# Altium schematic sheet OnkoMain.SchDoc
size A4
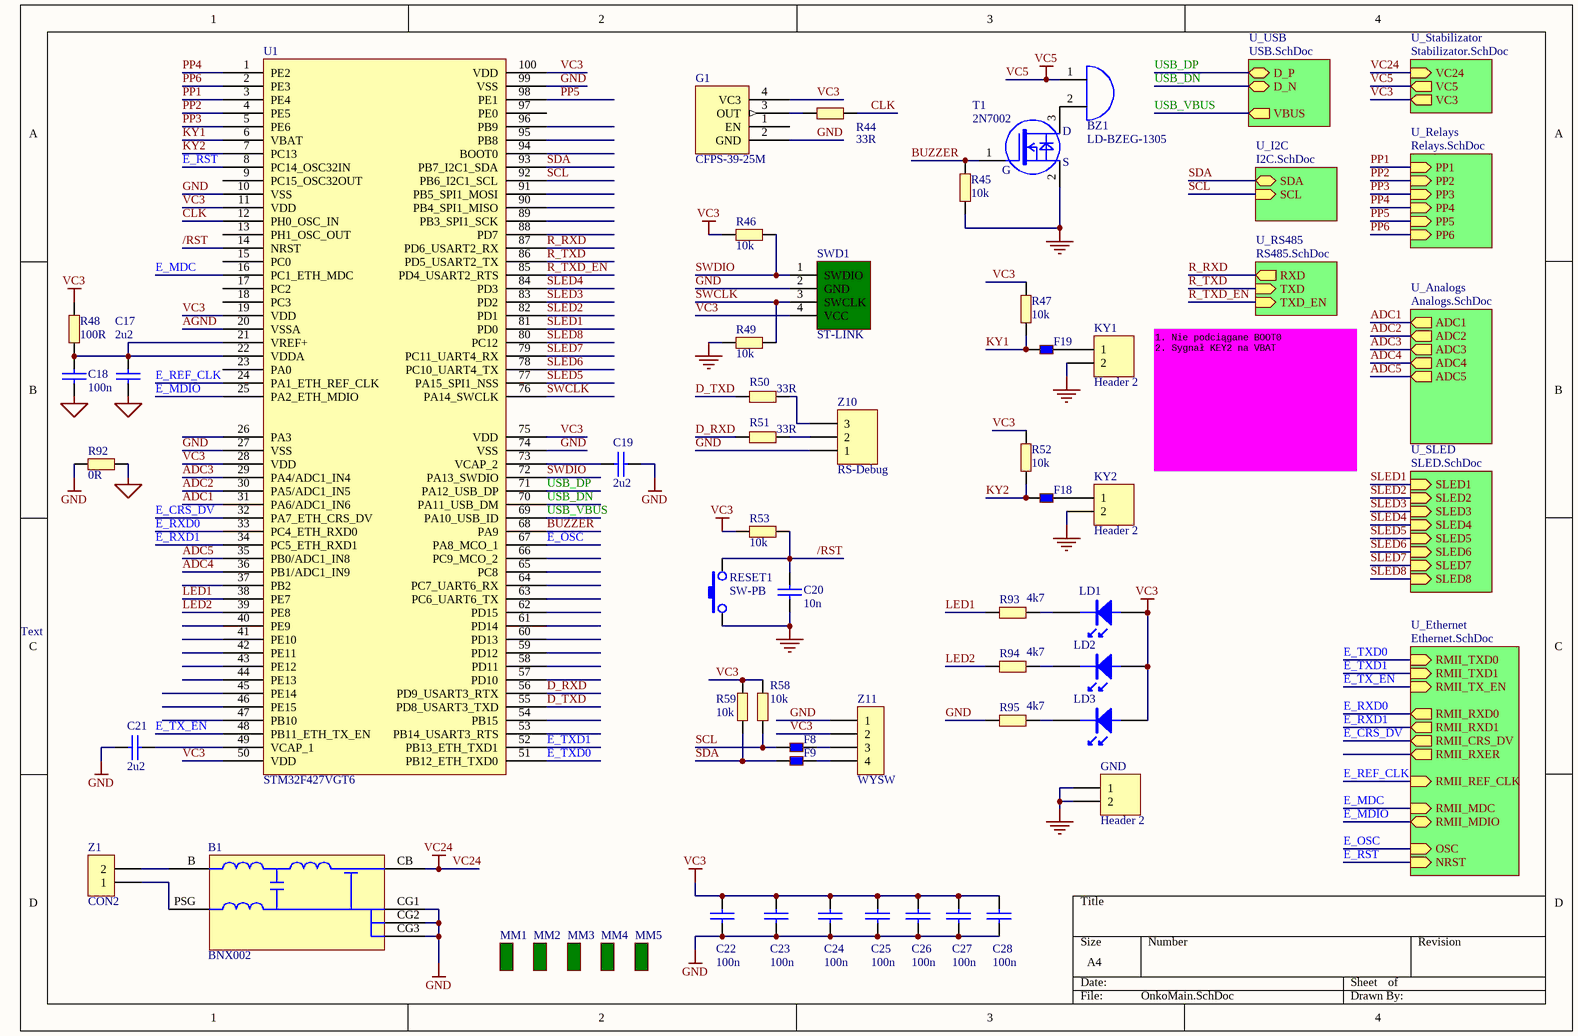
[diagram p0: OnkoMain.SchDoc]

## Parts
B1  BNX002  [BNX002]
BZ1  LD-BZEG-1305  [LD-BZEG-1305]
C17  2u2  [0805C]
C18  100n  [0805C]
C19  2u2  [0805C]
C20  10n  [0805C]
C21  2u2  [0805C]
C22  100n  [0805C]
C23  100n  [0805C]
C24  100n  [0805C]
C25  100n  [0805C]
C26  100n  [0805C]
C27  100n  [0805C]
C28  100n  [0805C]
F8  BLM18BB141SN1D  [0805L]  (value not drawn)
F9  BLM18BB141SN1D  [0805L]  (value not drawn)
F18  BLM18BB141SN1D  [0805L]  (value not drawn)
F19  BLM18BB141SN1D  [0805L]  (value not drawn)
G1  CFPS-39-25M  [GEN_SMD1_1]
GND  Header 2  [HDR1X2]
KY1  Header 2  [HDR1X2]
KY2  Header 2  [HDR1X2]
LD1  (no value)  [0805LG]
LD2  (no value)  [0805LR]
LD3  (no value)  [0805LG]
MM1  (no value)  [REF_CIR]
MM2  (no value)  [REF_CIR]
MM3  (no value)  [REF_SQR]
MM4  (no value)  [REF_SQR]
MM5  (no value)  [PB_FREE_GRAF]
R44  33R  [0805R]
R45  10k  [0805]
R46  10k  [0805R]
R47  10k  [0805R]
R48  100R  [0805]
R49  10k  [0805R]
R50  33R  [0805R]
R51  33R  [0805R]
R52  10k  [0805R]
R53  10k  [0805R]
R58  10k  [0805R]
R59  10k  [0805R]
R92  0R  [0805]
R93  4k7  [0805R]
R94  4k7  [0805R]
R95  4k7  [0805R]
RESET1  SW-PB  [DTSM31N_2]
SWD1  ST-LINK  [PIN4]
T1  2N7002  [SOT23]
U1  STM32F427VGT6  [VQ100_2]
Z1  CON2  [ARC-L-2-5.08]
Z10  RS-Debug  [PIN3]
Z11  WYSW  [PIN4]

## Sub-sheets
U_Analogs = Analogs.SchDoc: ADC1 (out), ADC2 (out), ADC3 (out), ADC4 (out), ADC5 (out)
U_Ethernet = Ethernet.SchDoc: RMII_TXD0 (in), RMII_TX_EN (in), RMII_RXD0 (out), RMII_REF_CLK (in), RMII_CRS_DV (out), RMII_MDC (in), RMII_MDIO (bidir), NRST (in), RMII_TXD1 (in), RMII_RXD1 (out), RMII_RXER (out), OSC (in)
U_I2C = I2C.SchDoc: SCL (in), SDA (bidir)
U_Relays = Relays.SchDoc: PP1 (in), PP2 (in), PP3 (in), PP4 (in), PP5 (in), PP6 (in)
U_RS485 = RS485.SchDoc: TXD (in), TXD_EN (in), RXD (out)
U_SLED = SLED.SchDoc: SLED1 (in), SLED2 (in), SLED3 (in), SLED4 (in), SLED5 (in), SLED6 (in), SLED7 (in), SLED8 (in)
U_Stabilizator = Stabilizator.SchDoc: VC5 (out), VC3 (out), VC24 (in)
U_USB = USB.SchDoc: D_N (bidir), D_P (bidir), VBUS (out)

## Nets
AGND: C17.2 C18.2 R92.1 U1.20(VSSA)
GND: B1.CG1 B1.CG2 B1.CG3 C19.1 C20.2 C21.1 C22.2 C23.2 C24.2 C25.2 C26.2 C27.2 C28.2 G1.2(GND) GND.1 GND.2 KY1.2 KY2.2 R45.2 R49.1 R92.2 R95.2 RESET1.1 SWD1.2(GND) T1.2(S) U1.10(VSS) U1.27(VSS) U1.74(VSS) U1.99(VSS) Z10.1 Z11.1
VC3: C22.1 C23.1 C24.1 C25.1 C26.1 C27.1 C28.1 G1.4(VC3) LD1.A LD2.A LD3.A R46.1 R47.2 R48.2 R52.2 R53.1 R58.2 R59.2 SWD1.4(VCC) U1.11(VDD) U1.19(VDD) U1.28(VDD) U1.50(VDD) U1.75(VDD) U1.100(VDD) Z11.2 ; sheet U_Stabilizator/VC3
VC5: BZ1.1 ; sheet U_Stabilizator/VC5
VC24: B1.CB ; sheet U_Stabilizator/VC24
/RST: C20.1 R53.2 RESET1.2 U1.14(NRST)
ADC1: U1.31(PA6/ADC1_IN6) ; sheet U_Analogs/ADC1
ADC2: U1.30(PA5/ADC1_IN5) ; sheet U_Analogs/ADC2
ADC3: U1.29(PA4/ADC1_IN4) ; sheet U_Analogs/ADC3
ADC4: U1.36(PB1/ADC1_IN9) ; sheet U_Analogs/ADC4
ADC5: U1.35(PB0/ADC1_IN8) ; sheet U_Analogs/ADC5
BUZZER: R45.1 T1.1 U1.68(PA9)
CLK: R44.2 U1.12(PH0_OSC_IN)
D_RXD: R51.2 U1.56(PD9_USART3_RTX)
D_TXD: R50.2 U1.55(PD8_USART3_TXD)
E_CRS_DV: U1.32(PA7_ETH_CRS_DV) ; sheet U_Ethernet/RMII_CRS_DV
E_MDC: U1.16(PC1_ETH_MDC) ; sheet U_Ethernet/RMII_MDC
E_MDIO: U1.25(PA2_ETH_MDIO) ; sheet U_Ethernet/RMII_MDIO
E_OSC: U1.67(PA8_MCO_1) ; sheet U_Ethernet/OSC
E_REF_CLK: U1.24(PA1_ETH_REF_CLK) ; sheet U_Ethernet/RMII_REF_CLK
E_RST: U1.8(PC14_OSC32IN) ; sheet U_Ethernet/NRST
E_RXD0: U1.33(PC4_ETH_RXD0) ; sheet U_Ethernet/RMII_RXD0
E_RXD1: U1.34(PC5_ETH_RXD1) ; sheet U_Ethernet/RMII_RXD1
E_TX_EN: U1.48(PB11_ETH_TX_EN) ; sheet U_Ethernet/RMII_TX_EN
E_TXD0: U1.51(PB12_ETH_TXD0) ; sheet U_Ethernet/RMII_TXD0
E_TXD1: U1.52(PB13_ETH_TXD1) ; sheet U_Ethernet/RMII_TXD1
KY1: F19.2 R47.1 U1.6(VBAT)
KY2: F18.2 R52.1 U1.7(PC13)
LED1: R93.2 U1.38(PE7)
LED2: R94.2 U1.39(PE8)
PP1: U1.3(PE4) ; sheet U_Relays/PP1
PP2: U1.4(PE5) ; sheet U_Relays/PP2
PP3: U1.5(PE6) ; sheet U_Relays/PP3
PP4: U1.1(PE2) ; sheet U_Relays/PP4
PP5: U1.98(PE1) ; sheet U_Relays/PP5
PP6: U1.2(PE3) ; sheet U_Relays/PP6
R_RXD: U1.87(PD6_USART2_RX) ; sheet U_RS485/RXD
R_TXD: U1.86(PD5_USART2_TX) ; sheet U_RS485/TXD
R_TXD_EN: U1.85(PD4_USART2_RTS) ; sheet U_RS485/TXD_EN
SCL: F8.2 R58.1 U1.92(PB6_I2C1_SCL) ; sheet U_I2C/SCL
SDA: F9.2 R59.1 U1.93(PB7_I2C1_SDA) ; sheet U_I2C/SDA
SLED1: U1.81(PD0) ; sheet U_SLED/SLED1
SLED2: U1.82(PD1) ; sheet U_SLED/SLED2
SLED3: U1.83(PD2) ; sheet U_SLED/SLED3
SLED4: U1.84(PD3) ; sheet U_SLED/SLED4
SLED5: U1.77(PA15_SPI1_NSS) ; sheet U_SLED/SLED5
SLED6: U1.78(PC10_UART4_TX) ; sheet U_SLED/SLED6
SLED7: U1.79(PC11_UART4_RX) ; sheet U_SLED/SLED7
SLED8: U1.80(PC12) ; sheet U_SLED/SLED8
SWCLK: R49.2 SWD1.3(SWCLK) U1.76(PA14_SWCLK)
SWDIO: R46.2 SWD1.1(SWDIO) U1.72(PA13_SWDIO)
USB_DN: U1.70(PA11_USB_DM) ; sheet U_USB/D_N
USB_DP: U1.71(PA12_USB_DP) ; sheet U_USB/D_P
USB_VBUS: U1.69(PA10_USB_ID) ; sheet U_USB/VBUS
NetB1_B: B1.B Z1.2
NetB1_PSG: B1.PSG Z1.1
NetBZ1_2: BZ1.2 T1.3(D)
NetC17_1: C17.1 C18.1 R48.1 U1.21(VREF+) U1.22(VDDA)
NetC19_2: C19.2 U1.73(VCAP_2)
NetC21_2: C21.2 U1.49(VCAP_1)
NetF8_1: F8.1 Z11.3
NetF9_1: F9.1 Z11.4
NetF18_1: F18.1 KY2.1
NetF19_1: F19.1 KY1.1
NetG1_3: G1.3(OUT) R44.1
NetLD1_K: LD1.K R93.1
NetLD2_K: LD2.K R94.1
NetLD3_K: LD3.K R95.1
NetR50_1: R50.1 Z10.3
NetR51_1: R51.1 Z10.2

Not connected (* = marked no-connect by the designer): G1 1(EN); U1 9(PC15_OSC32OUT) 13(PH1_OSC_OUT) 15(PC0) 17(PC2) 18(PC3) 23(PA0) 26(PA3) 37(PB2) 40(PE9) 41(PE10) 42(PE11) 43(PE12) 44(PE13) 45(PE14) 46(PE15) 47(PB10) 53(PB14_USART3_RTS) 54(PB15) 57(PD10) 58(PD11) 59(PD12) 60(PD13) 61(PD14) 62(PD15) 63(PC6_UART6_TX) 64(PC7_UART6_RX) 65(PC8) 66(PC9_MCO_2) 88(PD7) 89(PB3_SPI1_SCK) 90(PB4_SPI1_MISO) 91(PB5_SPI1_MOSI) 94(BOOT0) 95(PB8) 96(PB9) 97(PE0)

## Notes on the sheet
- 1. Nie podciągane BOOT0
  2. Sygnał KEY2 na VBAT
- Text
- (in symbol MOSFET-P_1_1) G

## Library data of the parts
BZ1 = BUZZER
C17-C28 = CAP: Capacitor
F8 F9 F18 F19 = KORALIK: Koralik ferrytowy
G1 = GENER_SMD
GND KY1 KY2 = Header 2: Header, 2-Pin; LatestRevisionDate: 17-Jul-2002; LatestRevisionNote: Re-released for DXP Platform.; Publisher: Altium Limited
LD1-LD3 = LED
MM1-MM5 = MECH
R44-R53 R58 R59 R92-R95 = RES3
SWD1 = SW_CON: Header, 4-Pin; LatestRevisionDate: 17-Jul-2002; LatestRevisionNote: Re-released for DXP Platform.; Publisher: Altium Limited
T1 = MOSFET-P_1_1
U1 = STM32F427_LQFP100
Z1 = CON2: Connector
Z10 = Header 3: Header, 3-Pin; LatestRevisionDate: 17-Jul-2002; LatestRevisionNote: Re-released for DXP Platform.; Publisher: Altium Limited
Z11 = CON4: Connector